# Altium project OX_V1_RA.PrjPcb (part 1 of 2)
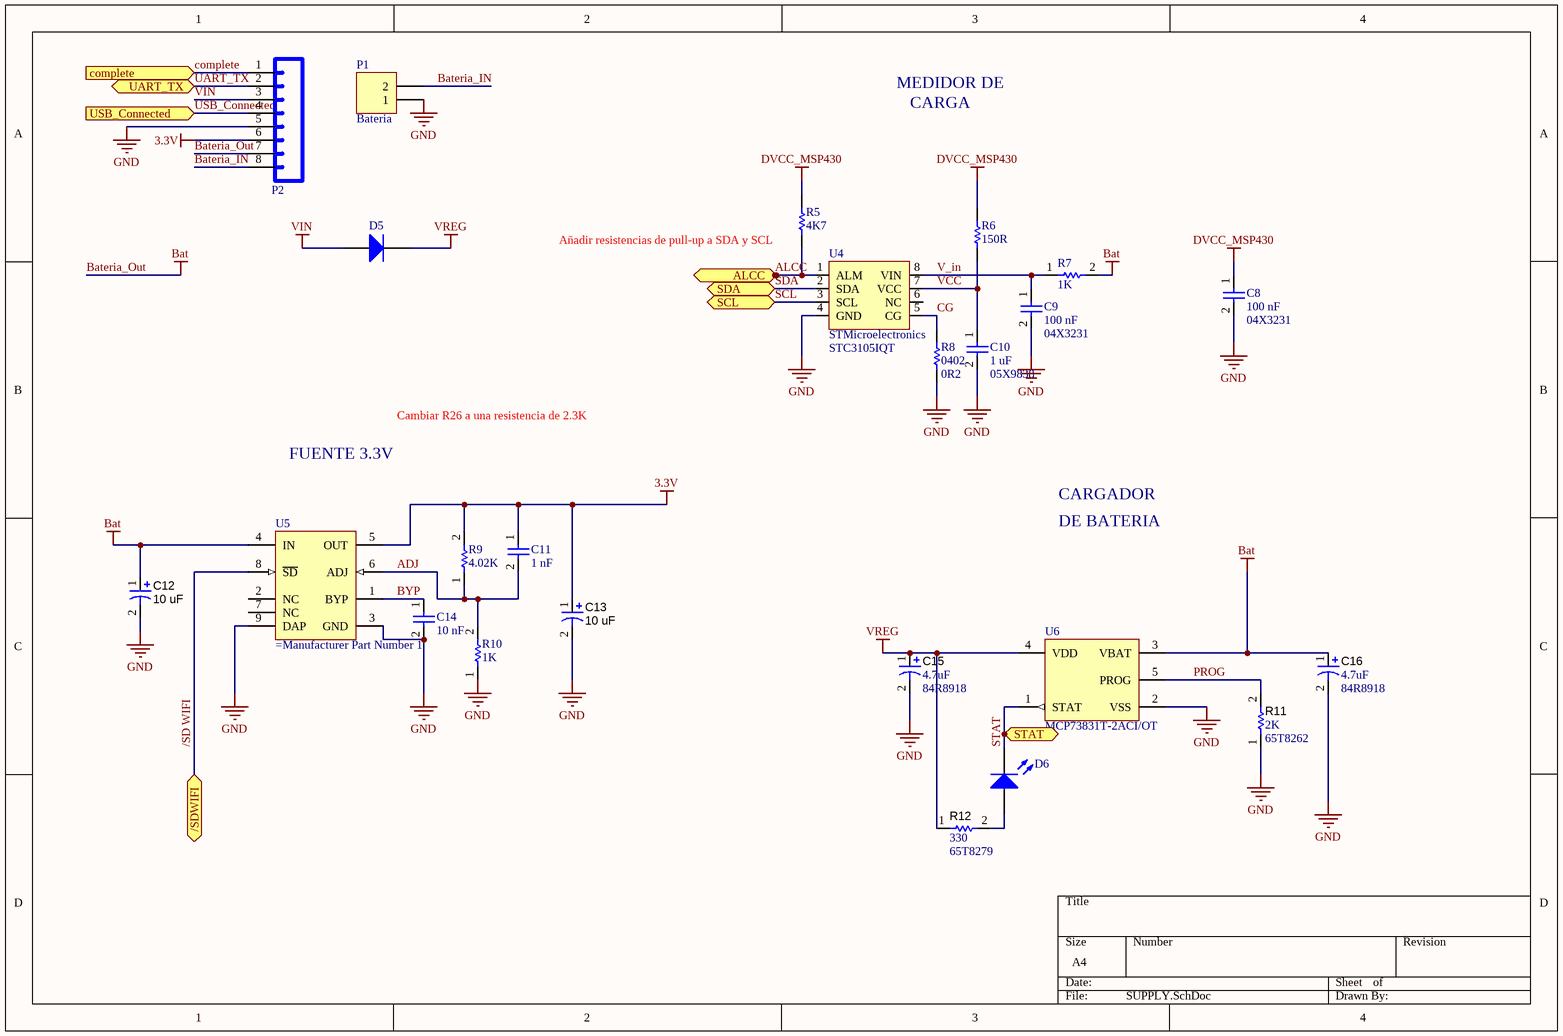
[diagram p0: SUPPLY.SchDoc]
4 sheets, 115 parts. Net scope: flat (ports and power ports of the same name join across sheets).
Board file: OX_V1_RA.PcbDoc
Sheets:
  SUPPLY.SchDoc
  MCU.SchDoc
  POWER.SchDoc
  AFE.SchDoc

## Sheet SUPPLY.SchDoc
size A4

### Parts
C8  100 nF  Supplier Part Number 1: 04X3231  [CR-0402]
C9  100 nF  Supplier Part Number 1: 04X3231  [CR-0402]
C10  1 uF  Supplier Part Number 1: 05X9838  [CR-0402]
C11  1 nF  [CR-0402]
C12  10 uF  [C-0603]
C13  10 uF  [C-0603]
C14  10 nF  [CR-0402]
C15  Supplier Part Number 1: 84R8918  [C-0603]  (hidden comment: 4.7uF)
C16  Supplier Part Number 1: 84R8918  [C-0603]  (hidden comment: 4.7uF)
D5  58K2394  [DO-214AA d]  (value not drawn)
D6  LED0  [CR-0402]  (value not drawn)
P1  Bateria  [HDR1X2]
P2  68000-236HLF  [HEAD8-NOSS]  (value not drawn)
R5  4K7  [CR-0402]
R6  150R  [CR-0402]
R7  1K  [CR-0402]
R8  0402  value 0R2  [R-0402]
R9  4.02K  [CR-0402]
R10  1K  [CR-0402]
R11  Supplier Part Number 1: 65T8262  [CR-0402]  (hidden comment: 2K)
R12  Supplier Part Number 1: 65T8279  [R-0402]  (hidden comment: 330)
U4  STMicroelectronics  Manufacturer Part Number 1: STC3105IQT  [TDFN8]
U5  (no value)  [SO8 DDA]
U6  MCP73831T-2ACI/OT  [SOT-23-5_3d]

### Ports
/SDWIFI (bidir), ALCC (bidir), complete (in), SCL (bidir), SDA (bidir), STAT (out), UART_TX (bidir), USB_Connected (in)

### Nets
3.3V: C11.1 C13.1(+) P2.6 R9.2 U5.5(OUT)
Bateria_Out: C12.1(+) C16.1(+) P2.7 R7.2 U5.4(IN) U6.3(VBAT)  [also labelled Bat]
DVCC_MSP430: C8.1 R5.2 R6.2  [project net 3V3]
GND: C8.2 C9.2 C10.2 C12.2(-) C13.2(-) C14.2 C15.2(-) C16.2(-) P1.1 P2.5 R8.1 R10.1 R11.1 U4.4(GND) U5.3(GND) U5.9(DAP) U6.2(VSS)  [project net AGND]
VIN: D5.1(A) P2.3
VREG: C15.1(+) D5.2(K) R12.1 U6.4(VDD)
/SD WIFI: U5.8(~{SD}) ; port /SDWIFI
ADJ: C11.2 R9.1 R10.2 U5.6(ADJ)
ALCC: R5.1 U4.1(ALM) ; port ALCC
Bateria_IN: P1.2 P2.8
BYP: C14.1 U5.1(BYP)
CG: R8.2 U4.5(CG)
complete: P2.1 ; port complete
PROG: R11.2 U6.5(PROG)
SCL: U4.3(SCL) ; port SCL
SDA: U4.2(SDA) ; port SDA
STAT: D6.2(K) U6.1(STAT) ; port STAT
UART_TX: P2.2 ; port UART_TX
USB_Connected: P2.4 ; port USB_Connected
V_in: C9.1 R7.1 U4.8(VIN)
VCC: C10.1 R6.1 U4.7(VCC)
NetD6_1: D6.1(A) R12.2

Not connected (* = marked no-connect by the designer): U4 6(NC); U5 2(NC) 7(NC)

### Notes on the sheet
- MEDIDOR DE
- CARGA
- (near R5) Añadir resistencias de pull-up a SDA y SCL
- Cambiar R26 a una resistencia de 2.3K
- FUENTE 3.3V
- CARGADOR
- DE BATERIA

### Library data of the parts
C8 C9 = C1005X7R1H104M050BB: TDK - C1005X7R1H104M050BB - CAP CERAMIC, 0.1UF, 50V, X7R, 0402; Value: 100 nF; Supplier 1: Newark; ComponentLink1URL: http://product.tdk.com/capacitor/mlcc/en/documents/mlcc_commercial_general_en.pdf; ComponentLink1Description: http://product.tdk.com/capacitor/mlcc/en/documents/mlcc_commercial_general_en.pdf; Supplier 2: Mouser; Supplier Part Number 2: 810-C1005X7R1H104M
C10 = C1005X5R1E105K050BC: TDK - C1005X5R1E105K050BC - CAP, MLCC, X5R, 1UF, 25V, 0402; Value: 1 uF; Supplier 1: Newark; ComponentLink1URL: http://www.farnell.com/datasheets/1796654.pdf; ComponentLink1Description: http://www.farnell.com/datasheets/1796654.pdf; Supplier 2: Mouser; Supplier Part Number 2: 810-C1005X5R1E105K
C11 = C1005X7R1E102K050BA: TDK - C1005X7R1E102K050BA - CAPACITOR CERAMIC 1000PF, 25V, X7R, 10%, 0402; Value: 1 nF; ComponentLink1URL: http://www.farnell.com/datasheets/1571323.pdf; ComponentLink1Description: http://www.farnell.com/datasheets/1571323.pdf; ComponentLink2URL: http://www.farnell.com/datasheets/1718611.pdf; ComponentLink2Description: http://www.farnell.com/datasheets/1718611.pdf; Supplier 1: Newark; Supplier Part Number 1: 90R7603; Supplier 2: Mouser; Supplier Part Number 2: 810-C1005X7R1E102K
C12 C13 = F981A106MMA: NICHICON - F981A106MMA - CAPACITOR TANT, 10UF, 10V 20%; Product Range: NICHICON - F98 Series; Capacitance: 10; Capacitor Case Style: 0603 ^1608 Metric]; ESR: 7.5; Value: 10 uF; Capacitance Tolerance: ± 20%; Voltage Rating: 10; Operating Temperature Max: 125; Series: F98; ComponentLink1URL: http://www.nichicon.co.jp/english/products/pdfs/e-f98.pdf; ComponentLink1Description: http://www.nichicon.co.jp/english/products/pdfs/e-f98.pdf; Supplier 1: Newark; Supplier Part Number 1: 70R1053; Supplier 2: Mouser; Supplier Part Number 2: 647-F981A106MMA
C14 = C1005X7R1H103K050BB: TDK - C1005X7R1H103K050BB - CAP CERAMIC, 0.01UF, 50V, X7R, 0402; Product Range: TDK - C Series; Capacitance: 0.01; Capacitance Tolerance: ± 10%; Dielectric Characteristic: X7; Voltage Rating: 50; Capacitor Case Style: 0402 ^1005 Metric]; Value: 10 nF; Packaging: Cut Tape; MSL: -; ComponentLink1URL: http://product.tdk.com/capacitor/mlcc/en/documents/mlcc_commercial_general_en.pdf; ComponentLink1Description: http://product.tdk.com/capacitor/mlcc/en/documents/mlcc_commercial_general_en.pdf; Supplier 1: Newark; Supplier Part Number 1: 04X3229; Supplier 2: Mouser; Supplier Part Number 2: 810-C1005X7R1H103K
C15 C16 = F981C475MMA: CAP, TANTALUM, 4.7UF, 20%, 16V, 20 OHM, SMT0603; PART NUMBER: F980J475MUA; MANUFACTURER: NICHICON; POPULATE: Y; CONSIGNED: N; VALUE: 4.7uF; Supplier 1: Newark; Supplier 2: Mouser; Supplier Part Number 2: 647-F981C475MMA
D5 = Diode: Default Diode; Published: 8-Jun-2000; LatestRevisionDate: 17-Jul-2002; LatestRevisionNote: Re-released for DXP Platform.; PackageVersion: Sep-1996; PackageReference: SMC; Publisher: Altium Limited; PackageDescription: DO-214-AB/SMC; 2 C-Bend Leads; Body 7.9 x 5.9 mm, inc. leads (LxW); Code_JEDEC: DO-214-AB; Supplier 1: Newark; Supplier Part Number 1: 58K2394; Supplier 2: Mouser; Supplier Part Number 2: 512-S2J
D6 = LED0: LED Blue; Published: 8-Jun-2000; LatestRevisionDate: 08-Jul-2005; LatestRevisionNote: Mech Layer 1 removed.; PackageReference: LED-0; Publisher: Altium Limited; PackageDescription: LED; 2 Leads; Supplier 1: Newark; Supplier Part Number 1: 75R0580; Supplier 2: Mouser; Supplier Part Number 2: 645-598-8091-107F
P1 = Header 2: Header, 2-Pin; LatestRevisionDate: 17-Jul-2002; LatestRevisionNote: Re-released for DXP Platform.; Publisher: Altium Limited
P2 = HEADER 1X8: Manufacturer: Amphenol FCI; Current Rating: 3 A; Mounting Angle: Straight; Number of Positions: 36 Position; Voltage Rating: 1.5 kV; Pitch: 2.54 mm; Insulation Resistance: 5 GOhms; Mating Post Length: 5.84 mm; Supplier 1: Mouser; Manufacturer Part Number: 68000-236HLF; RoHS: RoHS Compliant; Category: Headers & Wire Housings; Stock 1: 1164; Pricing 1: 1=1.89, 10=1.65, 100=1.47, 200=1.42, 500=1.23, 1000=1.00 (MXN); Contact Plating: Gold; Housing Material: Thermoplastic (TP); Number of Rows: 1 Row; Packaging: Bulk; Product: Headers; Termination Style: Solder Pin; Type: Pin Strip; Brand: Amphenol FCI; Contact Material: Phosphor Bronze; Flammability Rating: UL 94 V-0; Mounting Style: -; Contact Gender: Pin (Male); Housing Color: Black; Housing Gender: -; Maximum Operating Temperature: + 125 C; Minimum Operating Temperature: - 65 C; Product Type: Headers & Wire Housings; Standard Pack Qty: 100; Subcategory: Headers & Wire Housings; Termination Post Length: 2.41 mm; Tradename: BergStik; RoHS - Mouser: Y; Minimum Order Quantity: 1; Reeling: False; ComponentLink1URL: https://www.mouser.com/datasheet/2/18/68000-1266375.pdf; ComponentLink1Description: https://www.mouser.com/datasheet/2/18/68000-1266375.pdf; Supplier Part Number 1: 649-68000-236HLF
R5 = CRCW02014K70FNED: VISHAY DALE - CRCW02014K70FNED - THICK FILM RESISTOR, 4.7 KOHM, 50 mW, 1%, FULL REEL; Product Range: AEC-Q200 CRCW Series; Resistance: 4.7; Power Rating: 50; Resistor Case Style: 0201 [0603 Metric]; Resistance Tolerance: 1%; Resistor Element Type: Thick Film; ComponentLink1URL: http://www.farnell.com/datasheets/1719906.pdf; ComponentLink1Description: http://www.farnell.com/datasheets/1719906.pdf; Value: 4K7; Supplier 1: Newark; Supplier Part Number 1: 52K7045
R6 = CRCW0201150RFNED: VISHAY DALE - CRCW0201150RFNED - THICK FILM RESISTOR, 150 OHM, 50 mW, 1%, FULL REEL; Product Range: AEC-Q200 CRCW Series; Resistance: 150; Power Rating: 50; Resistor Case Style: 0201 [0603 Metric]; Resistance Tolerance: 1%; Resistor Element Type: Thick Film; MSL: -; ComponentLink1URL: http://www.farnell.com/datasheets/1719906.pdf; ComponentLink1Description: http://www.farnell.com/datasheets/1719906.pdf; Value: 150R; Supplier 1: Newark; Supplier Part Number 1: 52K6721
R7 R10 = CRCW02011K00FNED: VISHAY DALE - CRCW02011K00FNED - RESISTOR, THICK FILM CHIP, 1KOHM 50mW, 1%, FULL REEL; Value: 1K; ComponentLink1URL: http://www.vishay.com/docs/20035/dcrcwe3.pdf; ComponentLink1Description: http://www.vishay.com/docs/20035/dcrcwe3.pdf; Supplier 1: Newark; Supplier Part Number 1: 52K6545; Supplier 2: Mouser; Supplier Part Number 2: 71-CRCW02011K00FNED
R8 = ERJ-2BSFR20X: PANASONIC ELECTRONIC COMPONENTS - ERJ-2BSFR20X - RESISTOR, 0.2OHM, 166mW, 1%, SMD; Supplier 1: Newark; Stock 1: 1838; Pricing 1: 1=0.802, 50=0.332, 100=0.275, 250=0.218, 500=0.185, 1000=0.138, 2500=0.103 (USD); ComponentLink1URL: http://www.farnell.com/cad/1697901.zip; ComponentLink1Description: http://www.farnell.com/cad/1697901.zip; ComponentLink2URL: http://www.farnell.com/datasheets/1790602.pdf; ComponentLink2Description: http://www.farnell.com/datasheets/1790602.pdf; Supplier Part Number 1: 53W4138; Manufacturer 1: PANASONIC ELECTRONIC COMPONENTS; Manufacturer Part Number 1: ERJ-2BSFR20X; RoHS 1: YES; Description 1: PANASONIC ELECTRONIC COMPONENTS - ERJ-2BSFR20X - RESISTOR, 0.2OHM, 166mW, 1%, SMD; Supplier 2: Mouser; Supplier Part Number 2: 667-ERJ-2BSFR20X
R9 = CRCW02014K02FNED: VISHAY DALE - CRCW02014K02FNED - RESISTOR, THICK FILM, 4.02 KOHM, 50 mW, 1%, FULL REEL; Product Range: VISHAY - CRCW Series; Resistance: 4.02; Power Rating: 50; Resistor Case Style: 0201 ^0603 Metric]; Value: 4.02K; Supplier 1: Farnell; Stock 1: 9995; Pricing 1: 10000=0.007, 20000=0.007, 30000=0.007, 50000=0.006 (GBP); Resistance Tolerance: ± 1%; Resistor Element Type: Thick Film; ComponentLink1URL: http://www.farnell.com/datasheets/1700795.pdf; ComponentLink1Description: http://www.farnell.com/datasheets/1700795.pdf; Supplier Part Number 1: 2322928; Manufacturer 1: VISHAY DALE; Manufacturer Part Number 1: CRCW02014K02FNED; RoHS 1: YES; Description 1: VISHAY DALE - CRCW02014K02FNED - RESISTOR, THICK FILM, 4.02 KOHM, 50 mW, 1%, FULL REEL
R11 = ERJ-2GEJ202X: RESISTOR, THICK FILM, 2K, 5%, 0.1W, SMT0402; PARTNUMBER: PANASONIC; POPULATE: Y; CONSIGNED: N; PART NUMBER: ERJ-2GEJ202X; Supplier 1: Newark; VALUE: 2K; Supplier 2: Mouser; Supplier Part Number 2: 667-ERJ-2GEJ202X
R12 = ERJ-2GEJ331X: RESISTOR, THICK FILM, 330, 5%, 0.1W, SMT0402; MANUFACTURER: PANASONIC; POPULATE: Y; CONSIGNED: N; PART NUMBER: ERJ-2GEJ331X; Supplier 1: Newark; VALUE: 330; Supplier 2: Mouser; Supplier Part Number 2: 667-ERJ-2GEJ331X
U4 = STC3105: IC BATTERY MON GAS GAUGE 8-TDFN; Function: Fuel, Gas Gauge/Monitor; Voltage - Supply: 2.7 V ~ 5.5 V; Value: STC3105IQT; Supplier 1: Digi-Key; Category: Integrated Circuits (ICs); Stock 1: 49; Pricing 1: 1=1.9, 10=1.714, 25=1.5352, 100=1.3804, 250=1.22572, 500=1.071, 1000=0.88655 (USD); Packaging: Cut Tape (CT); Battery Chemistry: -; Operating Temperature: -40°C ~ 85°C; Mounting Type: Surface Mount; Package / Case: 8-WDFN; Supplier Device Package: 8-TDFN (3x2); ComponentLink1URL: http://www.st.com/web/en/resource/technical/document/datasheet/DM00037883.pdf; ComponentLink1Description: http://www.st.com/web/en/resource/technical/document/datasheet/DM00037883.pdf; Supplier Part Number 1: 497-12092-1-ND; Manufacturer 1: STMicroelectronics; RoHS 1: RoHS Compliant; Description 1: IC BATTERY MON GAS GAUGE 8-TDFN; Supplier 2: Mouser; Supplier Part Number 2: 511-STC3105IQT
U5 = LP3878MRX-ADJ/NOPB: TEXAS INSTRUMENTS - LP3878MRX-ADJ/NOPB - IC, LDO REGULATOR, 800mA, 1-5.5V, FULL REEL; Input Voltage Min: 2.5; Input Voltage Max: 16; Output Voltage Min: 1; Output Voltage Max: 5.5; Output Current: 800; Dropout Voltage Vdo: 475; No. of Pins: 8; Packaging: Tape & Reel; ComponentLink1URL: http://cache.national.com/ds/LP/LP3878-ADJ.pdf; ComponentLink1Description: http://cache.national.com/ds/LP/LP3878-ADJ.pdf; Supplier 1: Newark; Supplier Part Number 1: 65K6513; Supplier 2: Mouser; Supplier Part Number 2: 926-LP3878MRXADJNOPB
U6 = MCP73831T-2ACI/OT: Miniature Single-Cell, Fully Integrated Li-Ion, Li-Polymer Charge Management Controller, 4.2V, 5-Pin SOT-23, Industrial Temperature, Tape and Reel; Published: 29-Jan-2009; LatestRevisionDate: 27-Nov-2009; LatestRevisionNote: Updated to datasheet revision E, Sep-2008; DatasheetVersion: revE, Sep-2008; PackageVersion: revBB, Aug-2009; PackageReference: SOT-23-OT5; Publisher: Altium Limited; PackageDescription: 5-Lead Plastic Small Outline Transistor (OT) [SOT-23]; Supplier 1: Digi-Key; Supplier Part Number 1: MCP73831T-2ACI/OTCT-ND; Supplier 2: Farnell; Supplier Part Number 2: 1332158; Code_IPC: SOT23-5; ComponentLink1Description: Datasheet; ComponentLink1URL: http://ww1.microchip.com/downloads/en/DeviceDoc/21984e.pdf; ComponentLink2Description: Packaging Specification; ComponentLink2URL: http://www.microchip.com/stellent/groups/techpub_sg/documents/packagingspec/en012702.pdf; ComponentLink3Description: Microchip.com Home; ComponentLink3URL: http://www.microchip.com/; Supplier 3: Mouser; Supplier Part Number 3: 579-MCP73831T-2ACIOT

## Sheet MCU.SchDoc
size Legal
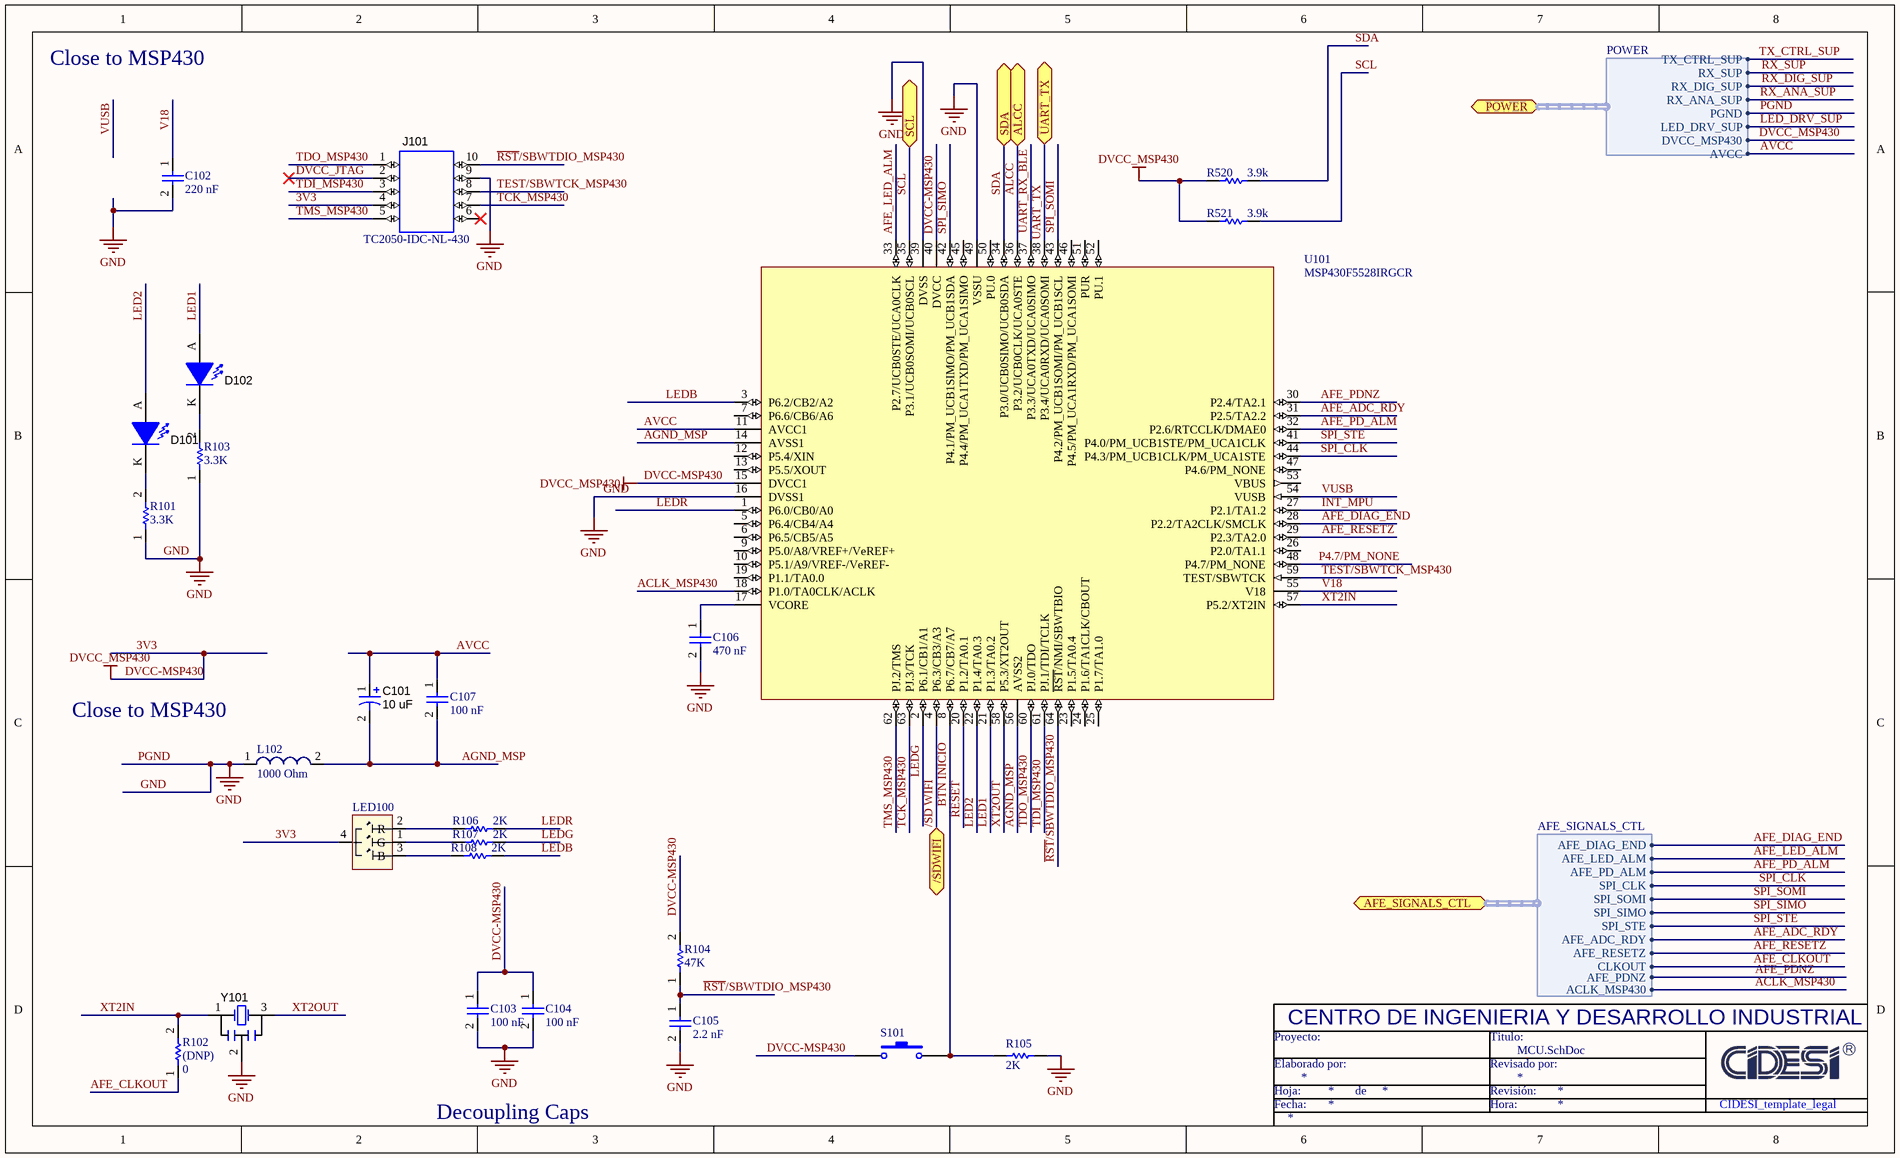
[diagram p1: MCU.SchDoc]

### Parts
C101  10 uF  [C0603_P]
C102  220 nF  [C0402]
C103  100 nF  [C0402]
C104  100 nF  [C0402]
C105  2.2 nF  [C0402]
C106  470 nF  [C0402]
C107  100 nF  [C0402]
D101  KPHHS-1005QBC-D-V  [LED_0402_BLUE]  (value not drawn)
D102  2290341  [LED_0402_GREEN]  (value not drawn)
J101  value TC2050-IDC-NL-430  [TC2050-IDC-NL]  (no BOM)
L102  1000 Ohm  [SMD 0402]
LED100  LED RGB AnodoComun  [LED-RGB 0606]  (value not drawn)
R101  3.3K  [0201]
R102  (DNP)  value 0  [0201]
R103  3.3K  [0201]
R104  47K  [0201]
R105  value 2K  [CR-0402]  (hidden comment: Res1)
R106  value 2K  [CR-0402]  (hidden comment: Res1)
R107  value 2K  [CR-0402]  (hidden comment: Res1)
R108  value 2K  [CR-0402]  (hidden comment: Res1)
R520  value 3.9k  [CR-0402]  (hidden comment: Res 3.9K)
R521  value 3.9k  [CR-0402]  (hidden comment: Res 3.9K)
S101  SW-PB  [TL3315]  (value not drawn)
U101  MSP430F5528IRGCR  [PVQFN-N64]
Y101  CSTCR4M00G15L99-R0  [CRYSTAL-2X4.5MM_3P]  (value not drawn)

### Ports
/SDWIFI (bidir), AFE_SIGNALS_CTL (harness AFE_SIGNALS_CTL), ALCC (bidir), POWER (harness POWER), SCL (bidir), SDA (bidir), UART_TX (bidir)

### Harnesses
POWER: AVCC, DVCC_MSP430, LED_DRV_SUP, PGND, RX_ANA_SUP, RX_DIG_SUP, RX_SUP, TX_CTRL_SUP
AFE_SIGNALS_CTL: CLKOUT, AFE_RESETZ, AFE_ADC_RDY, SPI_STE, SPI_SIMO, SPI_SOMI, SPI_CLK, AFE_PD_ALM, AFE_LED_ALM, AFE_DIAG_END, AFE_PDNZ, ACLK_MSP430

### Nets
3V3: C103.1 C104.1 J101.4 LED100.4 R104.2 R520.2 R521.2 S101.1 U101.15(DVCC1) U101.40(DVCC) ; port POWER.DVCC_MSP430  [also labelled DVCC-MSP430, DVCC_MSP430]
GND: C102.2 C103.2 C104.2 C105.2 C106.2 J101.9 L102.1 R101.1 R103.1 R105.1 U101.16(DVSS1) U101.39(DVSS) U101.49(VSSU) Y101.2 ; port POWER.PGND  [also labelled PGND]  [project net AGND]
/SD WIFI: U101.4(P6.3/CB3/A3) ; port /SDWIFI
ACLK_MSP430: U101.18(P1.0/TA0CLK/ACLK) ; port AFE_SIGNALS_CTL.ACLK_MSP430
AFE_ADC_RDY: U101.31(P2.5/TA2.2) ; port AFE_SIGNALS_CTL.AFE_ADC_RDY
AFE_CLKOUT: R102.1 ; port AFE_SIGNALS_CTL.CLKOUT
AFE_DIAG_END: U101.28(P2.2/TA2CLK/SMCLK) ; port AFE_SIGNALS_CTL.AFE_DIAG_END
AFE_LED_ALM: U101.33(P2.7/UCB0STE/UCA0CLK) ; port AFE_SIGNALS_CTL.AFE_LED_ALM
AFE_PD_ALM: U101.32(P2.6/RTCCLK/DMAE0) ; port AFE_SIGNALS_CTL.AFE_PD_ALM
AFE_PDNZ: U101.30(P2.4/TA2.1) ; port AFE_SIGNALS_CTL.AFE_PDNZ
AFE_RESETZ: U101.29(P2.3/TA2.0) ; port AFE_SIGNALS_CTL.AFE_RESETZ
AGND_MSP: C101.2(-) C107.2 L102.2 U101.14(AVSS1) U101.56(AVSS2)
ALCC: U101.36(P3.2/UCB0CLK/UCA0STE) ; port ALCC
AVCC: C101.1(+) C107.1 U101.11(AVCC1) ; port POWER.AVCC
BTN INICIO: R105.2 S101.2 U101.8(P6.7/CB7/A7)
DVCC_JTAG: J101.2
INT_MPU: U101.27(P2.1/TA1.2)
LED1: D102.A U101.21(P1.3/TA0.2)
LED2: D101.A U101.22(P1.4/TA0.3)
LEDB: R108.1 U101.3(P6.2/CB2/A2)
LEDG: R107.1 U101.2(P6.1/CB1/A1)
LEDR: R106.1 U101.1(P6.0/CB0/A0)
P4.7/PM_NONE: U101.48(P4.7/PM_NONE)
~{RST}/SBWTDIO_MSP430: C105.1 J101.10 R104.1 U101.64(~{RST}/NMI/SBWTBIO)
RESET: U101.20(P1.2/TA0.1)
SCL: R521.1 U101.35(P3.1/UCB0SOMI/UCB0SCL) ; port SCL
SDA: R520.1 U101.34(P3.0/UCB0SIMO/UCB0SDA) ; port SDA
SPI_CLK: U101.44(P4.3/PM_UCB1CLK/PM_UCA1STE) ; port AFE_SIGNALS_CTL.SPI_CLK
SPI_SIMO: U101.42(P4.1/PM_UCB1SIMO/PM_UCB1SDA) ; port AFE_SIGNALS_CTL.SPI_SIMO
SPI_SOMI: U101.43(P4.2/PM_UCB1SOMI/PM_UCB1SCL) ; port AFE_SIGNALS_CTL.SPI_SOMI
SPI_STE: U101.41(P4.0/PM_UCB1STE/PM_UCA1CLK) ; port AFE_SIGNALS_CTL.SPI_STE
TCK_MSP430: J101.7 U101.63(PJ.3/TCK)
TDI_MSP430: J101.3 U101.61(PJ.1/TDI/TCLK)
TDO_MSP430: J101.1 U101.60(PJ.0/TDO)
TEST/SBWTCK_MSP430: J101.8 U101.59(TEST/SBWTCK)
TMS_MSP430: J101.5 U101.62(PJ.2/TMS)
UART_RX_BLE: U101.37(P3.3/UCA0TXD/UCA0SIMO)
UART_TX: U101.38(P3.4/UCA0RXD/UCA0SOMI) ; port UART_TX
V18: C102.1 U101.55(V18)
VUSB: U101.54(VUSB)
XT2IN: R102.2 U101.57(P5.2/XT2IN) Y101.1
XT2OUT: U101.58(P5.3/XT2OUT) Y101.3
NetC106_1: C106.1 U101.17(VCORE)
NetD101_K: D101.K R101.2
NetD102_K: D102.K R103.2
NetLED100_1: LED100.1(G) R107.2
NetLED100_2: LED100.2(R) R106.2
NetLED100_3: LED100.3(B) R108.2

Not connected (* = marked no-connect by the designer): J101 6*; U101 5(P6.4/CB4/A4) 6(P6.5/CB5/A5) 7(P6.6/CB6/A6) 9(P5.0/A8/VREF+/VeREF+) 10(P5.1/A9/VREF-/VeREF-) 12(P5.4/XIN) 13(P5.5/XOUT) 19(P1.1/TA0.0) 23(P1.5/TA0.4) 24(P1.6/TA1CLK/CBOUT) 25(P1.7/TA1.0) 26(P2.0/TA1.1) 45(P4.4/PM_UCA1TXD/PM_UCA1SIMO) 46(P4.5/PM_UCA1RXD/PM_UCA1SOMI) 47(P4.6/PM_NONE) 50(PU.0) 51(PUR) 52(PU.1) 53(VBUS)

### Notes on the sheet
- Close to MSP430
- (near L102) Close to MSP430
- Decoupling Caps
- Proyecto:
- CENTRO DE INGENIERIA Y DESARROLLO INDUSTRIAL
- Titulo:
- Fecha:
- Hoja:
- Elaborado por:
- de
- Hora:
- Revisión:
- Revisado por:
- CIDESI_template_legal

### Library data of the parts
C101 = F981A106MMA: as C12 on sheet SUPPLY; Value: 10 uF; Supplier 1: Farnell; Stock 1: 9201; Pricing 1: 1=0.282, 10=0.236, 100=0.169, 250=0.148, 500=0.131, 1000=0.117 (GBP); Capacitance Tolerance: ± 20%; Voltage Rating: 10; Operating Temperature Max: 125; Series: F98; ComponentLink1URL: http://www.nichicon.co.jp/english/products/pdfs/e-f98.pdf; ComponentLink1Description: http://www.nichicon.co.jp/english/products/pdfs/e-f98.pdf; Supplier Part Number 1: 1853431; Manufacturer 1: NICHICON; Manufacturer Part Number 1: F981A106MMA; RoHS 1: YES; Description 1: NICHICON - F981A106MMA - CAPACITOR TANT, 10UF, 10V 20%; Supplier 2: Mouser; Supplier Part Number 2: 647-F981A106MMA
C102 = C1005X7R1C224K050BC: TDK - C1005X7R1C224K050BC - CAP CERAMIC, 0.22UF, 16V, X7R, 0402; Supplier 1: Farnell; Stock 1: 13525; Pricing 1: 1=0.021, 10=0.012, 100=0.01, 1000=0.009, 4000=0.009, 8000=0.009 (GBP); ComponentLink1URL: http://product.tdk.com/capacitor/mlcc/en/documents/mlcc_commercial_general_en.pdf; ComponentLink1Description: http://product.tdk.com/capacitor/mlcc/en/documents/mlcc_commercial_general_en.pdf; Supplier Part Number 1: 2394245; Manufacturer 1: TDK; Manufacturer Part Number 1: C1005X7R1C224K050BC; RoHS 1: YES; Description 1: TDK - C1005X7R1C224K050BC - CAP CERAMIC, 0.22UF, 16V, X7R, 0402; Value: 220 nF; Supplier 2: Mouser; Supplier Part Number 2: 810-C1005X7R1C224K
C103 C104 C107 = C1005X7R1H104M050BB: as C8 on sheet SUPPLY; Value: 100 nF; Supplier 1: Farnell; Stock 1: 15712; Pricing 1: 1=0.021, 10=0.012, 100=0.01, 1000=0.009, 4000=0.009, 8000=0.009 (GBP); ComponentLink1URL: http://product.tdk.com/capacitor/mlcc/en/documents/mlcc_commercial_general_en.pdf; ComponentLink1Description: http://product.tdk.com/capacitor/mlcc/en/documents/mlcc_commercial_general_en.pdf; Supplier Part Number 1: 2354090; Manufacturer 1: TDK; Manufacturer Part Number 1: C1005X7R1H104M050BB; RoHS 1: YES; Description 1: TDK - C1005X7R1H104M050BB - CAP CERAMIC, 0.1UF, 50V, X7R, 0402; Supplier 2: Mouser; Supplier Part Number 2: 810-C1005X7R1H104M
C105 = C1005X7R1H222K050BA: TDK - C1005X7R1H222K050BA - CAPACITOR CERAMIC 2200PF, 50V, X7R, 10%, 0402; Value: 2.2 nF; Supplier 1: Farnell; Stock 1: 9840; Pricing 1: 1=0.004, 10=0.002, 100=0.002, 1000=0.002, 2500=0.002, 10000=0.002 (GBP); ComponentLink1URL: http://www.farnell.com/datasheets/1571323.pdf; ComponentLink1Description: http://www.farnell.com/datasheets/1571323.pdf; ComponentLink2URL: http://www.farnell.com/datasheets/1718611.pdf; ComponentLink2Description: http://www.farnell.com/datasheets/1718611.pdf; Supplier Part Number 1: 1844139; Manufacturer 1: TDK; Manufacturer Part Number 1: C1005X7R1H222K050BA; RoHS 1: YES; Description 1: TDK - C1005X7R1H222K050BA - CAPACITOR CERAMIC 2200PF, 50V, X7R, 10%, 0402; Supplier 2: Mouser; Supplier Part Number 2: 810-C1005X7R1H222K
C106 = C1005X5R1E474K050BB: TDK - C1005X5R1E474K050BB - CAP CERAMIC, 0.47UF, 25V, X5R, 0402; Product Range: TDK - C Series; Capacitance: 0.47; Capacitance Tolerance: ± 10%; Dielectric Characteristic: X5; Voltage Rating: 25; Capacitor Case Style: 0402 ^1005 Metric]; Value: 470 nF; Supplier 1: Farnell; Stock 1: 17199; Pricing 1: 1=0.019, 10=0.009, 100=0.009, 1000=0.008, 2500=0.008, 10000=0.008 (GBP); Packaging: Cut Tape; MSL: -; ComponentLink1URL: http://product.tdk.com/capacitor/mlcc/en/documents/mlcc_commercial_general_en.pdf; ComponentLink1Description: http://product.tdk.com/capacitor/mlcc/en/documents/mlcc_commercial_general_en.pdf; Supplier Part Number 1: 2354077; Manufacturer 1: TDK; Manufacturer Part Number 1: C1005X5R1E474K050BB; RoHS 1: YES; Description 1: TDK - C1005X5R1E474K050BB - CAP CERAMIC, 0.47UF, 25V, X5R, 0402; Supplier 2: Mouser; Supplier Part Number 2: 810-C1005X5R1E474K
D101 = LNJ947W8CRA: KINGBRIGHT - KPHHS-1005QBC-D-V - LED, 0402, BLUE; Luminous Intensity: 100; Viewing Angle: 120°; Forward Current If: 20; Forward Voltage: 3.3; LED Mounting: SMD; Lens Shape: Rectangular; Wavelength Typ: 468; SVHC: No SVHC (16-Dec-2013; Supplier 1: Farnell; Supplier Part Number 1: 2290337; Manufacturer 1: KINGBRIGHT; Manufacturer Part Number 1: KPHHS-1005QBC-D-V; RoHS 1: YES; Description 1: KINGBRIGHT - KPHHS-1005QBC-D-V - LED, 0402, BLUE; Stock 1: 863; Pricing 1: 1=0.15, 10=0.135, 50=0.122, 100=0.12, 250=0.108, 500=0.0972, 500=0.0875, 3000=0.0787 (GBP); Bulb Size: -; LED Colour: Blue; Packaging: Each; MSL: MSL 3 - 168 hours; ComponentLink1URL: http://www.farnell.com/datasheets/1683504.pdf; ComponentLink1Description: http://www.farnell.com/datasheets/1683504.pdf; Supplier 2: Mouser; Supplier Part Number 2: 667-LNJ947W8CRA
D102 = APHHS1005CGCK: KINGBRIGHT - KPHHS-1005MGCK - LED, 0402, GREEN; Luminous Intensity: 60; Viewing Angle: 120°; Forward Current If: 20; Forward Voltage: 2.1; LED Mounting: SMD; Lens Shape: Rectangular; Wavelength Typ: 574; SVHC: No SVHC (16-Dec-2013; Supplier 1: Farnell; Supplier Part Number 1: 2290341; Manufacturer 1: KINGBRIGHT; Manufacturer Part Number 1: KPHHS-1005MGCK; RoHS 1: YES; Description 1: KINGBRIGHT - KPHHS-1005MGCK - LED, 0402, GREEN; Stock 1: 2970; Pricing 1: 1=0.173, 10=0.162, 50=0.151, 100=0.14, 250=0.13, 500=0.12, 500=0.108, 3000=0.0859 (GBP); Bulb Size: -; LED Colour: Green; Packaging: Each; MSL: MSL 3 - 168 hours; ComponentLink1URL: http://www.farnell.com/datasheets/1683503.pdf; ComponentLink1Description: http://www.farnell.com/datasheets/1683503.pdf; Supplier 2: Mouser; Supplier Part Number 2: 604-APHHS1005CGCK
J101 = TC2050-IDC-NL-430: CONNECTOR, PLUG OF NAILS CABLE, DUAL ROW, VERTICAL, 10-PIN; MANUFACTURER: TAG CONNECT; POPULATE: N; PART NUMBER: TC2050-IDC-NL-430; CONSIGNED: N
L102 = WE-CBF HF 0402, 742841210: SMD EMI Suppression Ferrite Beads WE-CBF HF, Z= 1000 Ohm; Manufacturer: Würth Elektronik eiSos GmbH; Manufacturer 1: WURTH ELEKTRONIK; Description 1: WURTH ELEKTRONIK - 742841210 - FERRITE BEAD, 1.8OHM, 50MA, 0402; partNo: 742841210; Impedance: 1000 Ohm; ComponentLink1Description: Manufacturer; ComponentLink1URL: http://www.we-online.de; Created by: Christin Zierenner; Created Date: May 2009; ComponentLink2Description: Datasheet; ComponentLink2URL: http://www.we-online.de/katalog/media/pdf/742841210.pdf; Supplier 1: Farnell; Supplier Part Number 1: 1748573; Manufacturer Part Number 1: 742841210; RoHS 1: YES; Stock 1: 220; Pricing 1: 1=0.31, 10=0.219, 50=0.19, 100=0.158, 250=0.126 (GBP); ComponentLink3URL: http://www.farnell.com/datasheets/1696154.pdf; ComponentLink3Description: http://www.farnell.com/datasheets/1696154.pdf; ComponentLink4URL: http://www.farnell.com/cad/1670055.zip; ComponentLink4Description: http://www.farnell.com/cad/1670055.zip; Supplier 2: Mouser; Supplier Part Number 2: 710-742841210
R101 R103 = CRCW02013K30FNED: VISHAY DALE - CRCW02013K30FNED - RESISTOR, THICK FILM, 3.3 KOHM, 50 mW, 1%, FULL REEL; Value: 3.3K; Supplier 1: Farnell; Stock 1: 9995; Pricing 1: 10000=0.007, 20000=0.007, 30000=0.006, 50000=0.006 (GBP); ComponentLink1URL: http://www.farnell.com/datasheets/1700795.pdf; ComponentLink1Description: http://www.farnell.com/datasheets/1700795.pdf; Supplier Part Number 1: 2322357; Manufacturer 1: VISHAY DALE; Manufacturer Part Number 1: CRCW02013K30FNED; RoHS 1: YES; Description 1: VISHAY DALE - CRCW02013K30FNED - RESISTOR, THICK FILM, 3.3 KOHM, 50 mW, 1%, FULL REEL
R102 = CRCW02010000Z0ED: VISHAY DALE - CRCW02010000Z0ED - RESISTOR, CHIP, JUMPER, ZERO OHM, 50mW, FULL REEL; Supplier 1: Farnell; Stock 1: 19995; Pricing 1: 10000=0.017, 20000=0.016, 30000=0.015 (GBP); ComponentLink1URL: http://www.vishay.com/docs/20035/dcrcwe3.pdf; ComponentLink1Description: http://www.vishay.com/docs/20035/dcrcwe3.pdf; Supplier Part Number 1: 2316008; Manufacturer 1: VISHAY DALE; Manufacturer Part Number 1: CRCW02010000Z0ED; RoHS 1: YES; Description 1: VISHAY DALE - CRCW02010000Z0ED - RESISTOR, CHIP, JUMPER, ZERO OHM, 50mW, FULL REEL; Supplier 2: Mouser; Supplier Part Number 2: 71-CRCW02010000Z0ED
R104 = CRCW020147K0FNED: VISHAY DALE - CRCW020147K0FNED - RESISTOR, THICK FILM, 47 KOHM, 50 mW, 1%, FULL REEL; Product Range: VISHAY - CRCW Series; Resistance: 47; Power Rating: 50; Resistor Case Style: 0201 ^0603 Metric]; Value: 47K; Supplier 1: Farnell; Stock 1: 9995; Pricing 1: 10000=0.007, 20000=0.007, 30000=0.006, 50000=0.006 (GBP); Resistance Tolerance: ± 1%; Resistor Element Type: Thick Film; MSL: -; ComponentLink1URL: http://www.farnell.com/datasheets/1700795.pdf; ComponentLink1Description: http://www.farnell.com/datasheets/1700795.pdf; Supplier Part Number 1: 2322005; Manufacturer 1: VISHAY DALE; Manufacturer Part Number 1: CRCW020147K0FNED; RoHS 1: YES; Description 1: VISHAY DALE - CRCW020147K0FNED - RESISTOR, THICK FILM, 47 KOHM, 50 mW, 1%, FULL REEL
R105-R108 = Res1: Resistor; Supplier 1: Newark; Supplier Part Number 1: 52K6788; Supplier 2: Mouser; Supplier Part Number 2: 71-CRCW0402-2.0K-E3
R520 R521 = Res1_1: Resistor; Supplier 1: Newark; Supplier Part Number 1: 52K6579; Supplier 2: Mouser; Supplier Part Number 2: 71-CRCW0402-1.62K-E3
S101 = SW-PB: Switch; Supplier 1: Newark; Supplier Part Number 1: 15N4507; Supplier 2: Mouser; Supplier Part Number 2: 612-TL3315NF160Q
U101 = MSP430F5528IRGC: TEXAS INSTRUMENTS - MSP430F5528IRGCR - MCU, 16BIT, MSP430, 25MHZ, VQFN-64; Program Memory Size: 128; RAM Memory Size: 10; CPU Speed: 25; No. of I/O's: 47; MCU Case Style: VQFN; No. of Pins: 64; Embedded Interface Type: I2; Supply Voltage Min: 1.8; Supply Voltage Max: 3.6; Core Size: 16; Peripherals: ADC, Comparator, PWM, Timer; SVHC: No SVHC (16-Dec-2013; Supplier 1: Farnell; Stock 1: 1985; Pricing 1: 2000=2.45 (GBP); Controller Family/Series: MSP430F5; Packaging: Tape & Reel; MSL: MSL 3 - 168 hours; Operating Temperature Max: 85; Operating Temperature Min: -40; ComponentLink1URL: http://www.farnell.com/datasheets/1726495.pdf; ComponentLink1Description: http://www.farnell.com/datasheets/1726495.pdf; ComponentLink2URL: http://www.farnell.com/datasheets/1698556.pdf; ComponentLink2Description: http://www.farnell.com/datasheets/1698556.pdf; Supplier Part Number 1: 2325742; Manufacturer 1: TEXAS INSTRUMENTS; Manufacturer Part Number 1: MSP430F5528IRGCR; RoHS 1: YES; Description 1: TEXAS INSTRUMENTS - MSP430F5528IRGCR - MCU, 16BIT, MSP430, 25MHZ, VQFN-64; Supplier 2: Mouser; Supplier Part Number 2: 595-MSP430F5528IRGCR
Y101 = CSTCR4M00G15L99-R0: CRYSTAL, PIEZO CERAMIC RESONATOR, 4.00 MHz,  +/-0.1%, 39pF, SMD; MANUFACTURER: MURATA; POPULATE: Y; CONSIGNED: N; VALUE: 4MHz; Description 1: Resonators 4MHZ; Frequency: 4 MHz; Tolerance: 0.5 %; Brand: Murata Electronics; PART NUMBER: CSTCR4M00G15L99-R0; Supplier 1: Mouser; Supplier Part Number 1: 81-CSTCR4M00G15L99R0; Manufacturer 1: Murata; Manufacturer Part Number 1: CSTCR4M00G15L99-R0; RoHS 1: RoHS Compliant; Category: Resonators; Stock 1: 3676; Pricing 1: 1=0.945, 10=0.667, 100=0.597, 1000=0.502, 3000=0.471, 9000=0.455, 24000=0.439 (AUD); Dimensions: 1.4 mm W x 4.1 mm L x 1.15 mm H; Packaging: Reel; Series: CSTCR; Termination Style: SMD/SMT; Standard Pack Qty: 3000; RoHS - Mouser: Y; Minimum Order Quantity: 1; Reeling: True; ComponentLink1URL: http://search.murata.co.jp/Ceramy/CatalogAction.do?sHinnm=?&nbsp&sNHinnm=CSTCR4M00G15L99-R0&sNhin_key=CSTCR4M00G15L99-R0&sLang=en&sParam=CSTCR; ComponentLink1Description: http://search.murata.co.jp/Ceramy/CatalogAction.do?sHinnm=?&nbsp&sNHinnm=CSTCR4M00G15L99-R0&sNhin_key=CSTCR4M00G15L99-R0&sLang=en&sParam=CSTCR
LED100 = LED RGB AnodoComun: Supplier 1: Newark; Supplier Part Number 1: 75R0622; Supplier 2: Mouser; Supplier Part Number 2: 645-598-8710-307F

## Sheet POWER.SchDoc
size Legal
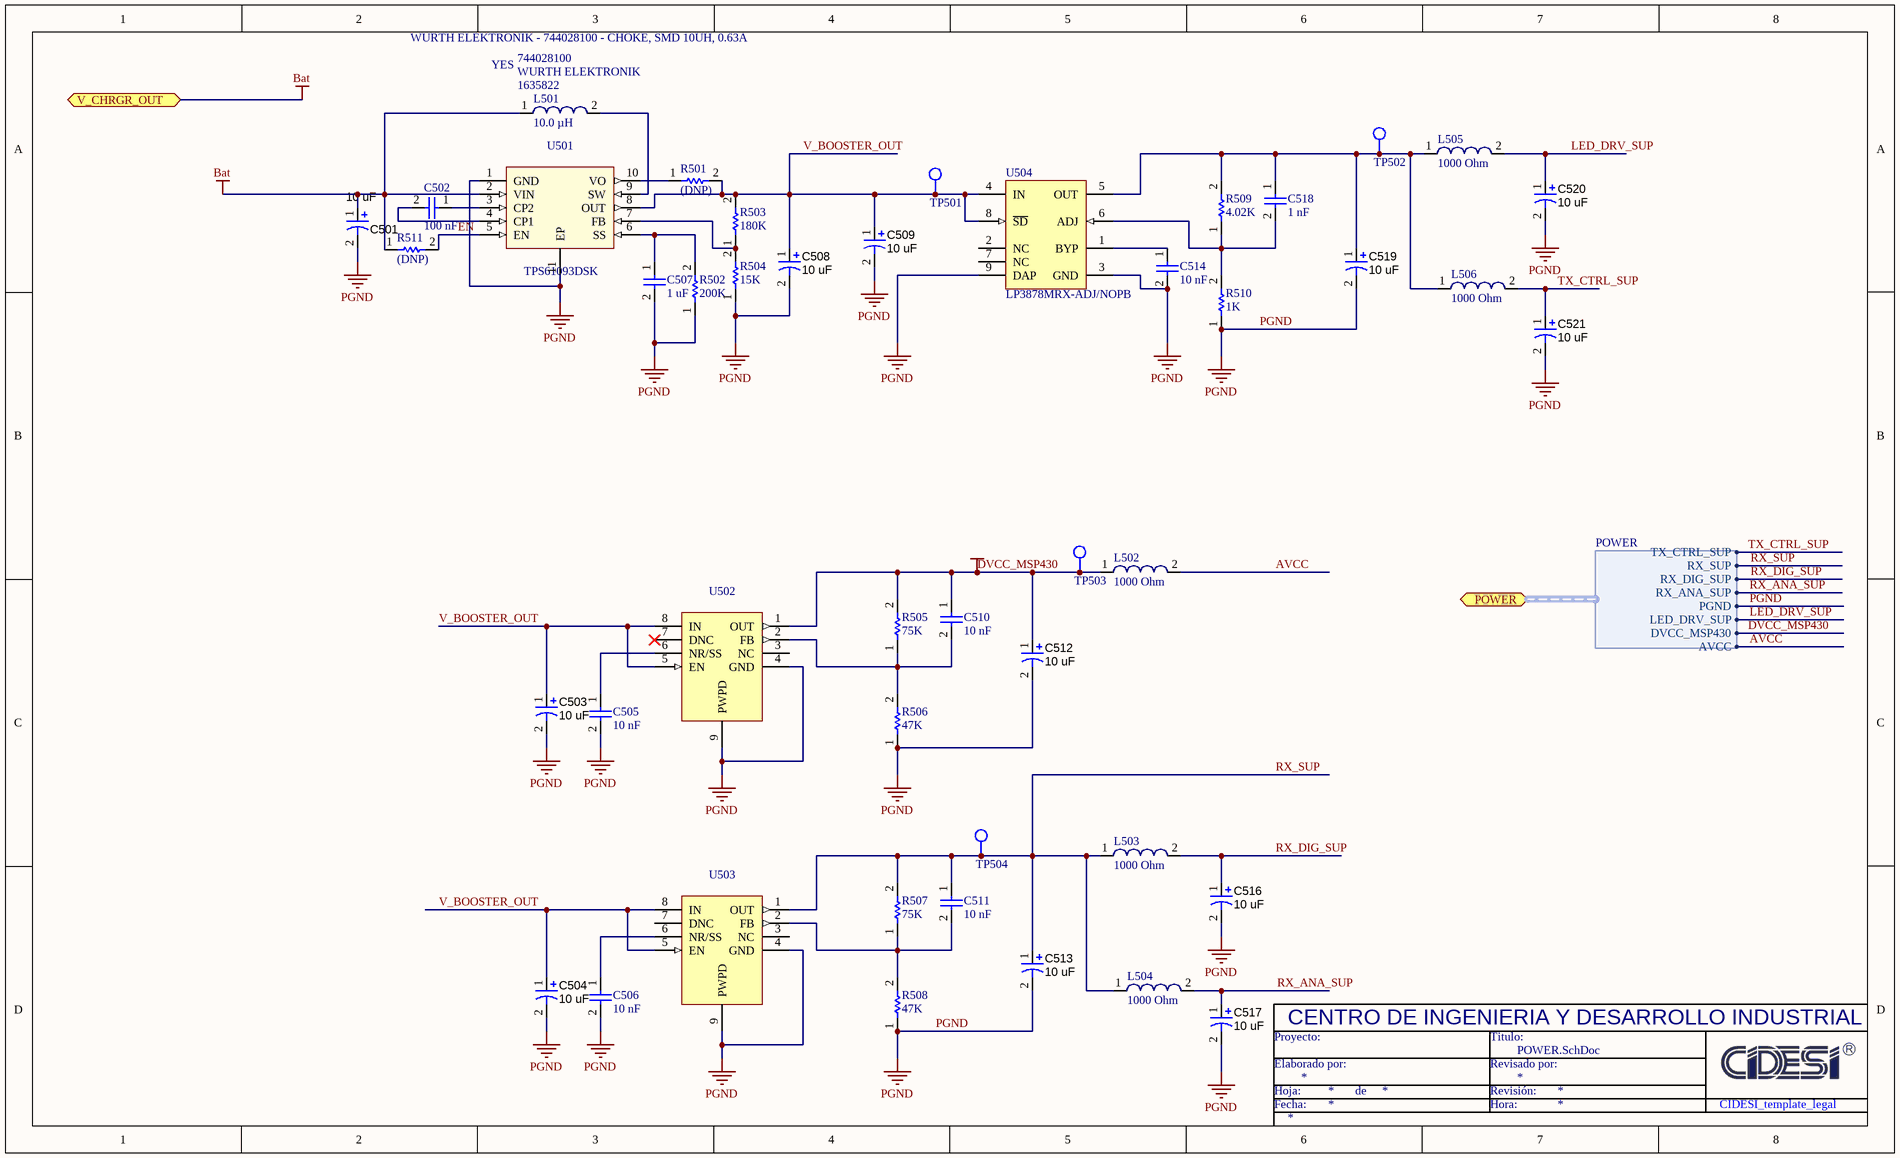
[diagram p2: POWER.SchDoc]

### Parts
C501  10 uF  [C0603_P]
C502  100 nF  [C0402]
C503  10 uF  [C0603_P]
C504  10 uF  [C0603_P]
C505  10 nF  [C0402]
C506  10 nF  [C0402]
C507  1 uF  [C0402]
C508  10 uF  [C0603_P]
C509  10 uF  [C0603_P]
C510  10 nF  [C0402]
C511  10 nF  [C0402]
C512  10 uF  [C0603_P]
C513  10 uF  [C0603_P]
C514  10 nF  [C0402]
C516  10 uF  [C0603_P]
C517  10 uF  [C0603_P]
C518  1 nF  [C0402]
C519  10 uF  [C0603_P]
C520  10 uF  [C0603_P]
C521  10 uF  [C0603_P]
L501  10.0 µH  Supplier Part Number 1: 1635822  Manufacturer 1: WURTH ELEKTRONIK  Manufacturer Part Number 1: 744028100  RoHS 1: YES  Description 1: WURTH ELEKTRONIK - 744028100 - CHOKE, SMD 10UH, 0.63A  [WE-TPC 2811, T]
L502  1000 Ohm  [SMD 0402]
L503  1000 Ohm  [SMD 0402]
L504  1000 Ohm  [SMD 0402]
L505  1000 Ohm  [SMD 0402]
L506  1000 Ohm  [SMD 0402]
R501  (DNP)  [0201]
R502  200K  [0201]
R503  180K  [0201]
R504  15K  [0201]
R505  75K  [0201]
R506  47K  [0201]
R507  75K  [0201]
R508  47K  [0201]
R509  4.02K  [0201]
R510  1K  [0201]
R511  (DNP)  [0201]
TP501  Test Point  [TestPoint]  (value not drawn)  (no BOM)
TP502  Test Point  [TestPoint]  (value not drawn)  (no BOM)
TP503  Test Point  [TestPoint]  (value not drawn)  (no BOM)
TP504  Test Point  [TestPoint]  (value not drawn)  (no BOM)
U501  TPS61093DSK  [DSK]
U502  TPS7A4901DGN  [DGN_8P]  (value not drawn)
U503  TPS7A4901DGN  [DGN_8P]  (value not drawn)
U504  LP3878MRX-ADJ/NOPB  [NGT]

### Ports
POWER (harness POWER), V_CHRGR_OUT (bidir)

### Harnesses
POWER: AVCC, DVCC_MSP430, LED_DRV_SUP, PGND, RX_ANA_SUP, RX_DIG_SUP, RX_SUP, TX_CTRL_SUP

### Nets
Bat: C501.1(+) L501.1 R511.1 U501.2(VIN) ; port V_CHRGR_OUT  [project net Bateria_Out]
DVCC_MSP430: C510.1 C512.1(+) L502.1 R505.2 TP503.1 U502.1(OUT) ; port POWER.DVCC_MSP430  [project net 3V3]
PGND: C501.2(-) C503.2(-) C504.2(-) C505.2 C506.2 C507.2 C508.2(-) C509.2(-) C512.2(-) C513.2(-) C514.2 C516.2(-) C517.2(-) C519.2(-) C520.2(-) C521.2(-) R502.1 R504.1 R506.1 R508.1 R510.1 U501.1(GND) U501.11(EP) U502.4(GND) U502.9(PWPD) U503.4(GND) U503.9(PWPD) U504.3(GND) U504.9(DAP) ; port POWER.PGND  [project net AGND]
AVCC: L502.2 ; port POWER.AVCC
EN: R511.2 U501.5(EN)
LED_DRV_SUP: C520.1(+) L505.2 ; port POWER.LED_DRV_SUP
RX_ANA_SUP: C517.1(+) L504.2 ; port POWER.RX_ANA_SUP
RX_DIG_SUP: C516.1(+) L503.2 ; port POWER.RX_DIG_SUP
RX_SUP: C511.1 C513.1(+) L503.1 L504.1 R507.2 TP504.1 U503.1(OUT) ; port POWER.RX_SUP
TX_CTRL_SUP: C521.1(+) L506.2 ; port POWER.TX_CTRL_SUP
V_BOOSTER_OUT: C503.1(+) C504.1(+) C508.1(+) C509.1(+) R501.2 R503.2 TP501.1 U501.8(OUT) U502.5(EN) U502.8(IN) U503.5(EN) U503.8(IN) U504.4(IN) U504.8(~{SD})
NetC502_1: C502.1 U501.3(CP2)
NetC502_2: C502.2 U501.4(CP1)
NetC505_1: C505.1 U502.6(NR/SS)
NetC506_1: C506.1 U503.6(NR/SS)
NetC507_1: C507.1 R502.2 U501.6(SS)
NetC510_2: C510.2 R505.1 R506.2 U502.2(FB)
NetC511_2: C511.2 R507.1 R508.2 U503.2(FB)
NetC514_1: C514.1 U504.1(BYP)
NetC518_1: C518.1 C519.1(+) L505.1 L506.1 R509.2 TP502.1 U504.5(OUT)
NetC518_2: C518.2 R509.1 R510.2 U504.6(ADJ)
NetL501_2: L501.2 U501.9(SW)
NetR501_1: R501.1 U501.10(VO)
NetR503_1: R503.1 R504.2 U501.7(FB)

Not connected (* = marked no-connect by the designer): U502 3(NC) 7(DNC)*; U503 3(NC) 7(DNC); U504 2(NC) 7(NC)

### Notes on the sheet
- Proyecto:
- CENTRO DE INGENIERIA Y DESARROLLO INDUSTRIAL
- Titulo:
- Fecha:
- Hoja:
- Elaborado por:
- de
- Hora:
- Revisión:
- Revisado por:
- CIDESI_template_legal

### Library data of the parts
C501 C503 C504 C508 C509 C512 C513 C516 C517 C519-C521 = F981A106MMA: as C12 on sheet SUPPLY; Value: 10 uF; Supplier 1: Farnell; Stock 1: 9201; Pricing 1: 1=0.282, 10=0.236, 100=0.169, 250=0.148, 500=0.131, 1000=0.117 (GBP); Capacitance Tolerance: ± 20%; Voltage Rating: 10; Operating Temperature Max: 125; Series: F98; ComponentLink1URL: http://www.nichicon.co.jp/english/products/pdfs/e-f98.pdf; ComponentLink1Description: http://www.nichicon.co.jp/english/products/pdfs/e-f98.pdf; Supplier Part Number 1: 1853431; Manufacturer 1: NICHICON; Manufacturer Part Number 1: F981A106MMA; RoHS 1: YES; Description 1: NICHICON - F981A106MMA - CAPACITOR TANT, 10UF, 10V 20%; Supplier 2: Mouser; Supplier Part Number 2: 647-F981A106MMA
C502 = C1005X7R1H104M050BB: as C8 on sheet SUPPLY; Value: 100 nF; Supplier 1: Farnell; Stock 1: 15712; Pricing 1: 1=0.021, 10=0.012, 100=0.01, 1000=0.009, 4000=0.009, 8000=0.009 (GBP); ComponentLink1URL: http://product.tdk.com/capacitor/mlcc/en/documents/mlcc_commercial_general_en.pdf; ComponentLink1Description: http://product.tdk.com/capacitor/mlcc/en/documents/mlcc_commercial_general_en.pdf; Supplier Part Number 1: 2354090; Manufacturer 1: TDK; Manufacturer Part Number 1: C1005X7R1H104M050BB; RoHS 1: YES; Description 1: TDK - C1005X7R1H104M050BB - CAP CERAMIC, 0.1UF, 50V, X7R, 0402; Supplier 2: Mouser; Supplier Part Number 2: 810-C1005X7R1H104M
C505 C506 C510 C511 C514 = C1005X7R1H103K050BB: as C14 on sheet SUPPLY; Value: 10 nF; Supplier 1: Farnell; Stock 1: 36; Pricing 1: 1=0.011, 10=0.005, 100=0.005, 1000=0.005, 2500=0.005 (GBP); Packaging: Cut Tape; MSL: -; ComponentLink1URL: http://product.tdk.com/capacitor/mlcc/en/documents/mlcc_commercial_general_en.pdf; ComponentLink1Description: http://product.tdk.com/capacitor/mlcc/en/documents/mlcc_commercial_general_en.pdf; Supplier Part Number 1: 2354088; Manufacturer 1: TDK; Manufacturer Part Number 1: C1005X7R1H103K050BB; RoHS 1: YES; Description 1: TDK - C1005X7R1H103K050BB - CAP CERAMIC, 0.01UF, 50V, X7R, 0402; Supplier 2: Mouser; Supplier Part Number 2: 810-C1005X7R1H103K
C507 = C1005X5R1E105K050BC: as C10 on sheet SUPPLY; Value: 1 uF; Supplier 1: Farnell; Stock 1: 5210; Pricing 1: 1=0.045, 10=0.04, 100=0.036, 250=0.029, 500=0.023, 10000=0.016 (GBP); ComponentLink1URL: http://www.farnell.com/datasheets/1796654.pdf; ComponentLink1Description: http://www.farnell.com/datasheets/1796654.pdf; Supplier Part Number 1: 2346884; Manufacturer 1: TDK; Manufacturer Part Number 1: C1005X5R1E105K050BC; RoHS 1: YES; Description 1: TDK - C1005X5R1E105K050BC - CAP, MLCC, X5R, 1UF, 25V, 0402; Supplier 2: Mouser; Supplier Part Number 2: 810-C1005X5R1E105K
C518 = C1005X7R1E102K050BA: as C11 on sheet SUPPLY; Value: 1 nF; Supplier 1: Farnell; Stock 1: 7460; Pricing 1: 1=0.004, 10=0.002, 100=0.002, 1000=0.002, 2500=0.002, 10000=0.002 (GBP); ComponentLink1URL: http://www.farnell.com/datasheets/1571323.pdf; ComponentLink1Description: http://www.farnell.com/datasheets/1571323.pdf; ComponentLink2URL: http://www.farnell.com/datasheets/1718611.pdf; ComponentLink2Description: http://www.farnell.com/datasheets/1718611.pdf; Supplier Part Number 1: 1844132; Manufacturer 1: TDK; Manufacturer Part Number 1: C1005X7R1E102K050BA; RoHS 1: YES; Description 1: TDK - C1005X7R1E102K050BA - CAPACITOR CERAMIC 1000PF, 25V, X7R, 10%, 0402; Supplier 2: Mouser; Supplier Part Number 2: 810-C1005X7R1E102K
L501 = WE-TPC 2811, T, 744028100: SMD Shielded Tiny Power Inductor WE-TPC, L=10.0 µH; Manufacturer: Würth Elektronik eiSos GmbH; partNo: 744028100; Inductance: 10.0 µH; ComponentLink1Description: Manufacturer; ComponentLink1URL: http://www.we-online.de; Created by: Christin Zierenner; Created Date: July 2009; ComponentLink2Description: Datasheet; ComponentLink2URL: http://www.we-online.de/katalog/media/pdf/744028100.pdf; Supplier 1: Farnell; Stock 1: 557; Pricing 1: 1=0.9, 10=0.86, 50=0.84, 100=0.81, 250=0.75 (GBP); ComponentLink3URL: http://www.farnell.com/datasheets/69345.pdf; ComponentLink3Description: http://www.farnell.com/datasheets/69345.pdf; ComponentLink4URL: http://www.farnell.com/cad/1670106.zip; ComponentLink4Description: http://www.farnell.com/cad/1670106.zip
L502-L506 = WE-CBF HF 0402, 742841210: as L102 on sheet MCU; partNo: 742841210; Impedance: 1000 Ohm; ComponentLink1Description: Manufacturer; ComponentLink1URL: http://www.we-online.de; Created by: Christin Zierenner; Created Date: May 2009; ComponentLink2Description: Datasheet; ComponentLink2URL: http://www.we-online.de/katalog/media/pdf/742841210.pdf; Supplier 1: Farnell; Supplier Part Number 1: 1748573; Manufacturer Part Number 1: 742841210; RoHS 1: YES; Stock 1: 220; Pricing 1: 1=0.31, 10=0.219, 50=0.19, 100=0.158, 250=0.126 (GBP); ComponentLink3URL: http://www.farnell.com/datasheets/1696154.pdf; ComponentLink3Description: http://www.farnell.com/datasheets/1696154.pdf; ComponentLink4URL: http://www.farnell.com/cad/1670055.zip; ComponentLink4Description: http://www.farnell.com/cad/1670055.zip; Supplier 2: Mouser; Supplier Part Number 2: 710-742841210
R501 R511 = CRCW02010000Z0ED: VISHAY DALE - CRCW02010000Z0ED - RESISTOR, CHIP, JUMPER, ZERO OHM, 50mW, FULL REEL; Value: 0; Supplier 1: Farnell; Stock 1: 19995; Pricing 1: 10000=0.017, 20000=0.016, 30000=0.015 (GBP); ComponentLink1URL: http://www.vishay.com/docs/20035/dcrcwe3.pdf; ComponentLink1Description: http://www.vishay.com/docs/20035/dcrcwe3.pdf; Supplier Part Number 1: 2316008; Manufacturer 1: VISHAY DALE; Manufacturer Part Number 1: CRCW02010000Z0ED; RoHS 1: YES; Description 1: VISHAY DALE - CRCW02010000Z0ED - RESISTOR, CHIP, JUMPER, ZERO OHM, 50mW, FULL REEL; Supplier 2: Mouser; Supplier Part Number 2: 71-CRCW02010000Z0ED
R502 = CRCW0201200KFNED: VISHAY DALE - CRCW0201200KFNED - RESISTOR, THICK FILM, 200 KOHM, 50 mW, 1%, FULL REEL; Value: 200K; Supplier 1: Farnell; Stock 1: 9995; Pricing 1: 10000=0.007, 20000=0.007, 30000=0.006, 50000=0.006 (GBP); ComponentLink1URL: http://www.farnell.com/datasheets/1700795.pdf; ComponentLink1Description: http://www.farnell.com/datasheets/1700795.pdf; Supplier Part Number 1: 2321987; Manufacturer 1: VISHAY DALE; Manufacturer Part Number 1: CRCW0201200KFNED; RoHS 1: Y-EX; Description 1: VISHAY DALE - CRCW0201200KFNED - RESISTOR, THICK FILM, 200 KOHM, 50 mW, 1%, FULL REEL
R503 = CRCW0201180KFNED: VISHAY DALE - CRCW0201180KFNED - RESISTOR, THICK FILM, 180 KOHM, 50 mW, 1%, FULL REEL; Value: 180K; Supplier 1: Farnell; Stock 1: 19995; Pricing 1: 10000=0.078, 20000=0.078, 30000=0.075, 50000=0.066 (GBP); ComponentLink1URL: http://www.farnell.com/datasheets/1700795.pdf; ComponentLink1Description: http://www.farnell.com/datasheets/1700795.pdf; Supplier Part Number 1: 2321951; Manufacturer 1: VISHAY DALE; Manufacturer Part Number 1: CRCW0201180KFNED; RoHS 1: YES; Description 1: VISHAY DALE - CRCW0201180KFNED - RESISTOR, THICK FILM, 180 KOHM, 50 mW, 1%, FULL REEL
R504 = CRCW020115K0FNED: VISHAY DALE - CRCW020115K0FNED - RESISTOR, THICK FILM, 15 KOHM, 50 mW, 1%, FULL REEL; Value: 15K; Supplier 1: Farnell; Stock 1: 9995; Pricing 1: 10000=0.007, 20000=0.007, 30000=0.007, 50000=0.006 (GBP); ComponentLink1URL: http://www.farnell.com/datasheets/1700795.pdf; ComponentLink1Description: http://www.farnell.com/datasheets/1700795.pdf; Supplier Part Number 1: 2321583; Manufacturer 1: VISHAY DALE; Manufacturer Part Number 1: CRCW020115K0FNED; RoHS 1: YES; Description 1: VISHAY DALE - CRCW020115K0FNED - RESISTOR, THICK FILM, 15 KOHM, 50 mW, 1%, FULL REEL
R505 R507 = CRCW020175K0FNED: VISHAY DALE - CRCW020175K0FNED - RESISTOR, THICK FILM, 75 KOHM, 50 mW, 1%, FULL REEL; Value: 75K; Supplier 1: Farnell; Stock 1: 9995; Pricing 1: 10000=0.007, 20000=0.007, 30000=0.006, 50000=0.006 (GBP); ComponentLink1URL: http://www.farnell.com/datasheets/1700795.pdf; ComponentLink1Description: http://www.farnell.com/datasheets/1700795.pdf; Supplier Part Number 1: 2321623; Manufacturer 1: VISHAY DALE; Manufacturer Part Number 1: CRCW020175K0FNED; RoHS 1: YES; Description 1: VISHAY DALE - CRCW020175K0FNED - RESISTOR, THICK FILM, 75 KOHM, 50 mW, 1%, FULL REEL
R506 R508 = CRCW020147K0FNED: as R104 on sheet MCU; Value: 47K; Supplier 1: Farnell; Stock 1: 9995; Pricing 1: 10000=0.007, 20000=0.007, 30000=0.006, 50000=0.006 (GBP); Resistance Tolerance: ± 1%; Resistor Element Type: Thick Film; MSL: -; ComponentLink1URL: http://www.farnell.com/datasheets/1700795.pdf; ComponentLink1Description: http://www.farnell.com/datasheets/1700795.pdf; Supplier Part Number 1: 2322005; Manufacturer 1: VISHAY DALE; Manufacturer Part Number 1: CRCW020147K0FNED; RoHS 1: YES; Description 1: VISHAY DALE - CRCW020147K0FNED - RESISTOR, THICK FILM, 47 KOHM, 50 mW, 1%, FULL REEL
R509 = CRCW02014K02FNED: as R9 on sheet SUPPLY; Value: 4.02K; Supplier 1: Farnell; Stock 1: 9995; Pricing 1: 10000=0.007, 20000=0.007, 30000=0.007, 50000=0.006 (GBP); Resistance Tolerance: ± 1%; Resistor Element Type: Thick Film; ComponentLink1URL: http://www.farnell.com/datasheets/1700795.pdf; ComponentLink1Description: http://www.farnell.com/datasheets/1700795.pdf; Supplier Part Number 1: 2322928; Manufacturer 1: VISHAY DALE; Manufacturer Part Number 1: CRCW02014K02FNED; RoHS 1: YES; Description 1: VISHAY DALE - CRCW02014K02FNED - RESISTOR, THICK FILM, 4.02 KOHM, 50 mW, 1%, FULL REEL
R510 = CRCW02011K00FNED: as R7 on sheet SUPPLY; Value: 1K; Supplier 1: Farnell; Pricing 1: 10000=0.022, 20000=0.022, 30000=0.022, 50000=0.019 (GBP); ComponentLink1URL: http://www.vishay.com/docs/20035/dcrcwe3.pdf; ComponentLink1Description: http://www.vishay.com/docs/20035/dcrcwe3.pdf; Supplier Part Number 1: 2321243; Manufacturer 1: VISHAY DALE; Manufacturer Part Number 1: CRCW02011K00FNED; RoHS 1: YES; Description 1: VISHAY DALE - CRCW02011K00FNED - RESISTOR, THICK FILM CHIP, 1KOHM 50mW, 1%, FULL REEL; Supplier 2: Mouser; Supplier Part Number 2: 71-CRCW02011K00FNED
TP501-TP504 = TestPoint
U501 = TPS61093DSK: IC, LOW INPUT BOOST CONVERTER WITH INTEGRATED POWER DIODE AND ISOLATION, SON-10, DSK; MANUFACTURER: TEXAS INSTRUMENTS; Manufacturer Part Number 1: TPS61093DSKR; POPULATE: Y; Description 1: Voltage Regulators - Switching Regulators Low In 20V/1.1A Step Up DC/DC Converter; Number of Outputs: 1; Output Current: 1 A; Output Voltage: 17 V; Switching Frequency: 1.2 MHz; PART NUMBER: TPS61093DSK; CONSIGNED: Y; Supplier 1: Mouser; Supplier Part Number 1: 595-TPS61093DSKR; Manufacturer 1: Texas Instruments; RoHS 1: RoHS Compliant; Category: Voltage Regulators - Switching Regulators; Stock 1: 0; Pricing 1: 3000=1.82 (AUD); Packaging: Reel; Series: TPS61093; Type: Boost Converters; Brand: Texas Instruments; Maximum Operating Temperature: + 85 C; Minimum Operating Temperature: - 40 C; Product Category: Converters - DC/DC; Standard Pack Qty: 3000; RoHS - Mouser: Y; Minimum Order Quantity: 3000; Reeling: True; ComponentLink1URL: http://www.mouser.com/ds/2/405/slvs992a-121117.pdf; ComponentLink1Description: http://www.mouser.com/ds/2/405/slvs992a-121117.pdf
U502 U503 = TPS7A4901DGN: IC, ULTRALOW NOISE, HIGH-PSRR, LDO REGULATOR, VIN 3V TO 35V, 150mA ,MSOP-8, DGN; MANUFACTURER: TEXAS INSTRUMENTS; Manufacturer Part Number 1: TPS7A4901DGNT; POPULATE: Y; Description 1: TEXAS INSTRUMENTS - TPS7A4901DGNT - IC, ADJ LDO REG, 1.2V-33V, 0.15A, MSOP-8; CONSIGNED: Y; PART NUMBER: TPS7A4901DGN; Supplier 1: Farnell; Supplier Part Number 1: 2395583; Manufacturer 1: TEXAS INSTRUMENTS; RoHS 1: YES; Stock 1: 111; Pricing 1: 1=2.501, 10=2.235, 25=2.017, 50=1.92, 100=1.831 (GBP); ComponentLink1URL: http://www.farnell.com/simulation/1746546.zip; ComponentLink1Description: http://www.farnell.com/simulation/1746546.zip; ComponentLink2URL: http://www.ti.com/lit/ds/symlink/tps7a4901.pdf; ComponentLink2Description: http://www.ti.com/lit/ds/symlink/tps7a4901.pdf; ComponentLink3URL: http://www.farnell.com/cad/1610996.zip; ComponentLink3Description: http://www.farnell.com/cad/1610996.zip; Supplier 2: Mouser; Supplier Part Number 2: 595-TPS7A4901DGNT
U504 = LP3878MRX-ADJ/NOPB: Manufacturer 1: TEXAS INSTRUMENTS; Input Voltage Min: 2.5; Input Voltage Max: 16; Output Voltage Min: 1; Output Voltage Max: 5.5; Output Current: 800; Dropout Voltage Vdo: 475; No. of Pins: 8; Description 1: TEXAS INSTRUMENTS - LP3878MRX-ADJ/NOPB - IC, LDO REGULATOR, 800mA, 1-5.5V, FULL REEL; Supplier 1: Newark; Stock 1: 0; Pricing 1: 2500=0.9 (USD); Packaging: Tape & Reel; ComponentLink1URL: http://cache.national.com/ds/LP/LP3878-ADJ.pdf; ComponentLink1Description: http://cache.national.com/ds/LP/LP3878-ADJ.pdf; Supplier Part Number 1: 65K6514; RoHS 1: YES; Manufacturer Part Number 1: LP3878MRX-ADJ/NOPB; Supplier 2: Mouser; Supplier Part Number 2: 926-LP3878MRXADJNOPB